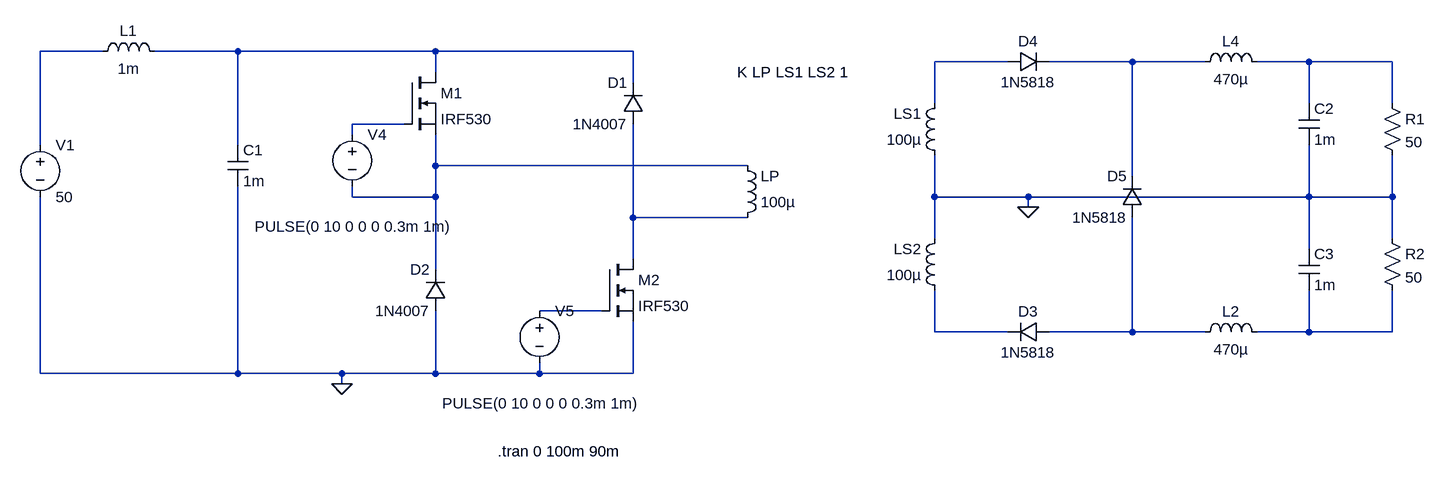
[diagram p0: schematic test.asc]
test.asc, the LTspice schematic file:
Version 4.1
SHEET 1 2504 720
WIRE 128 -48 32 -48
WIRE 336 -48 208 -48
WIRE 640 -48 336 -48
WIRE 944 -48 640 -48
WIRE 1520 -32 1408 -32
WIRE 1712 -32 1584 -32
WIRE 1824 -32 1712 -32
WIRE 1984 -32 1904 -32
WIRE 2112 -32 1984 -32
WIRE 640 -16 640 -48
WIRE 944 0 944 -48
WIRE 1408 32 1408 -32
WIRE 1984 32 1984 -32
WIRE 2112 32 2112 -32
WIRE 592 64 512 64
WIRE 512 80 512 64
WIRE 32 96 32 -48
WIRE 336 96 336 -48
WIRE 640 128 640 80
WIRE 1120 128 640 128
WIRE 1712 144 1712 -32
WIRE 512 176 512 160
WIRE 640 176 640 128
WIRE 640 176 512 176
WIRE 1408 176 1408 112
WIRE 1552 176 1408 176
WIRE 1984 176 1984 96
WIRE 1984 176 1552 176
WIRE 2112 176 2112 112
WIRE 2112 176 1984 176
WIRE 1552 192 1552 176
WIRE 944 208 944 64
WIRE 1120 208 944 208
WIRE 1408 240 1408 176
WIRE 2112 240 2112 176
WIRE 1984 256 1984 176
WIRE 944 272 944 208
WIRE 640 288 640 176
WIRE 896 352 800 352
WIRE 1408 384 1408 320
WIRE 1520 384 1408 384
WIRE 1712 384 1712 208
WIRE 1712 384 1584 384
WIRE 1824 384 1712 384
WIRE 1984 384 1984 320
WIRE 1984 384 1904 384
WIRE 2112 384 2112 320
WIRE 2112 384 1984 384
WIRE 32 448 32 176
WIRE 336 448 336 160
WIRE 336 448 32 448
WIRE 496 448 336 448
WIRE 640 448 640 352
WIRE 640 448 496 448
WIRE 800 448 800 432
WIRE 800 448 640 448
WIRE 944 448 944 368
WIRE 944 448 800 448
WIRE 496 464 496 448
FLAG 496 464 0
FLAG 1552 192 0
SYMBOL voltage 32 80 R0
WINDOW 123 0 0 Left 0
WINDOW 39 0 0 Left 0
SYMATTR InstName V1
SYMATTR Value 50
SYMBOL ind 112 -32 R270
WINDOW 0 32 56 VTop 2
WINDOW 3 5 56 VBottom 2
SYMATTR InstName L1
SYMATTR Value 1m
SYMBOL cap 320 96 R0
SYMATTR InstName C1
SYMATTR Value 1m
SYMBOL nmos 592 -16 R0
SYMATTR InstName M1
SYMATTR Value IRF530
SYMBOL nmos 896 272 R0
SYMATTR InstName M2
SYMATTR Value IRF530
SYMBOL ind 1104 224 M180
WINDOW 0 36 80 Left 2
WINDOW 3 36 40 Left 2
SYMATTR InstName LP
SYMATTR Value 100µ
SYMATTR Type ind
SYMBOL diode 960 64 R180
WINDOW 0 24 64 Left 2
WINDOW 3 24 0 Left 2
SYMATTR InstName D1
SYMATTR Value 1N4007
SYMBOL ind 1424 128 R180
WINDOW 0 36 80 Left 2
WINDOW 3 36 40 Left 2
SYMATTR InstName LS1
SYMATTR Value 100µ
SYMATTR Type ind
SYMBOL ind 1808 -16 R270
WINDOW 0 32 56 VTop 2
WINDOW 3 5 56 VBottom 2
SYMATTR InstName L4
SYMATTR Value 470µ
SYMBOL cap 1968 32 R0
SYMATTR InstName C2
SYMATTR Value 1m
SYMBOL res 2096 16 R0
SYMATTR InstName R1
SYMATTR Value 50
SYMBOL voltage 512 64 R0
WINDOW 3 -150 158 Left 2
WINDOW 123 0 0 Left 0
WINDOW 39 0 0 Left 0
SYMATTR Value PULSE(0 10 0 0 0 0.3m 1m)
SYMATTR InstName V4
SYMBOL voltage 800 336 R0
WINDOW 3 -150 158 Left 2
WINDOW 123 0 0 Left 0
WINDOW 39 0 0 Left 0
SYMATTR Value PULSE(0 10 0 0 0 0.3m 1m)
SYMATTR InstName V5
SYMBOL ind 1424 336 R180
WINDOW 0 36 80 Left 2
WINDOW 3 36 40 Left 2
SYMATTR InstName LS2
SYMATTR Value 100µ
SYMATTR Type ind
SYMBOL ind 1808 400 R270
WINDOW 0 32 56 VTop 2
WINDOW 3 5 56 VBottom 2
SYMATTR InstName L2
SYMATTR Value 470µ
SYMBOL cap 1968 256 R0
SYMATTR InstName C3
SYMATTR Value 1m
SYMBOL res 2096 224 R0
SYMATTR InstName R2
SYMATTR Value 50
SYMBOL diode 1520 -16 R270
WINDOW 0 32 32 VTop 2
WINDOW 3 0 32 VBottom 2
SYMATTR InstName D4
SYMATTR Value 1N5818
SYMBOL diode 656 352 R180
WINDOW 0 24 64 Left 2
WINDOW 3 24 0 Left 2
SYMATTR InstName D2
SYMATTR Value 1N4007
SYMBOL diode 1584 368 R90
WINDOW 0 0 32 VBottom 2
WINDOW 3 32 32 VTop 2
SYMATTR InstName D3
SYMATTR Value 1N5818
SYMBOL diode 1728 208 R180
WINDOW 0 24 64 Left 2
WINDOW 3 24 0 Left 2
SYMATTR InstName D5
SYMATTR Value 1N5818
TEXT 1104 -16 Left 2 !K LP LS1 LS2 1
TEXT 736 568 Left 2 !.tran 0 100m 90m

The netlist it stands for:
* test.asc
V1 N001 0 50
L1 N001 N002 1m
C1 N002 0 1m
M1 N002 N006 N007 N007 IRF530
M2 N008 N009 0 0 IRF530
LP N008 N007 100µ
D1 N008 N002 1N4007
LS1 0 N003 100µ
L4 N004 N005 470µ
C2 N005 0 1m
R1 N005 0 50
V4 N006 N007 PULSE(0 10 0 0 0 0.3m 1m)
V5 N009 0 PULSE(0 10 0 0 0 0.3m 1m)
LS2 N010 0 100µ
L2 N011 N012 470µ
C3 0 N012 1m
R2 0 N012 50
D4 N003 N004 1N5818
D2 0 N007 1N4007
D3 N011 N010 1N5818
D5 N011 N004 1N5818
.model D D
.lib standard.dio
.model NMOS NMOS
.model PMOS PMOS
.lib standard.mos
K LP LS1 LS2 1
.tran 0 100m 90m
.backanno
.end